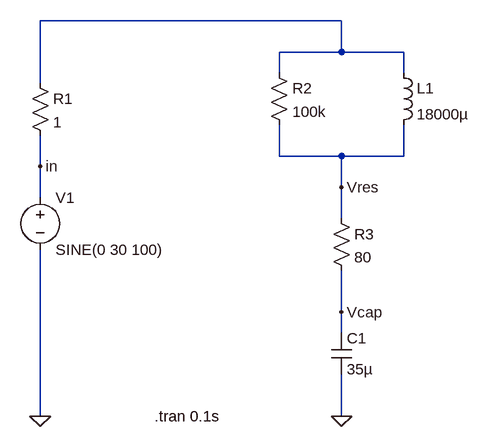
[diagram p0: schematic draft.asc]
draft.asc, the LTspice schematic file:
Version 4
SHEET 1 880 1056
WIRE 512 432 48 432
WIRE 512 480 512 432
WIRE 512 480 416 480
WIRE 608 480 512 480
WIRE 416 512 416 480
WIRE 608 512 608 480
WIRE 48 528 48 432
WIRE 416 640 416 592
WIRE 512 640 416 640
WIRE 608 640 608 592
WIRE 608 640 512 640
WIRE 48 656 48 608
WIRE 512 688 512 640
WIRE 48 704 48 656
WIRE 512 736 512 688
WIRE 512 880 512 816
WIRE 512 912 512 880
WIRE 48 1040 48 784
WIRE 512 1040 512 976
FLAG 48 1040 0
FLAG 512 1040 0
FLAG 512 688 Vres
FLAG 512 880 Vcap
FLAG 48 656 in
SYMBOL /voltage 48 688 R0
SYMATTR InstName V1
SYMATTR Value SINE(0 30 100)
SYMBOL /res 32 512 R0
SYMATTR InstName R1
SYMATTR Value 1
SYMBOL /res 400 496 R0
SYMATTR InstName R2
SYMATTR Value 100k
SYMBOL /ind 592 496 R0
SYMATTR InstName L1
SYMATTR Value 18000µ
SYMBOL /cap 496 912 R0
SYMATTR InstName C1
SYMATTR Value 35µ
SYMBOL /res 496 720 R0
SYMATTR InstName R3
SYMATTR Value 80
TEXT 224 1040 Left 2 !.tran 0.1s

The netlist it stands for:
* draft.asc
V1 in 0 SINE(0 30 100)
R1 N001 in 1
R2 N001 Vres 100k
L1 N001 Vres 18000µ
C1 Vcap 0 35µ
R3 Vres Vcap 80
.tran 0.1s
.backanno
.end